# Altium project Urukul.PrjPCB (part 1 of 4)
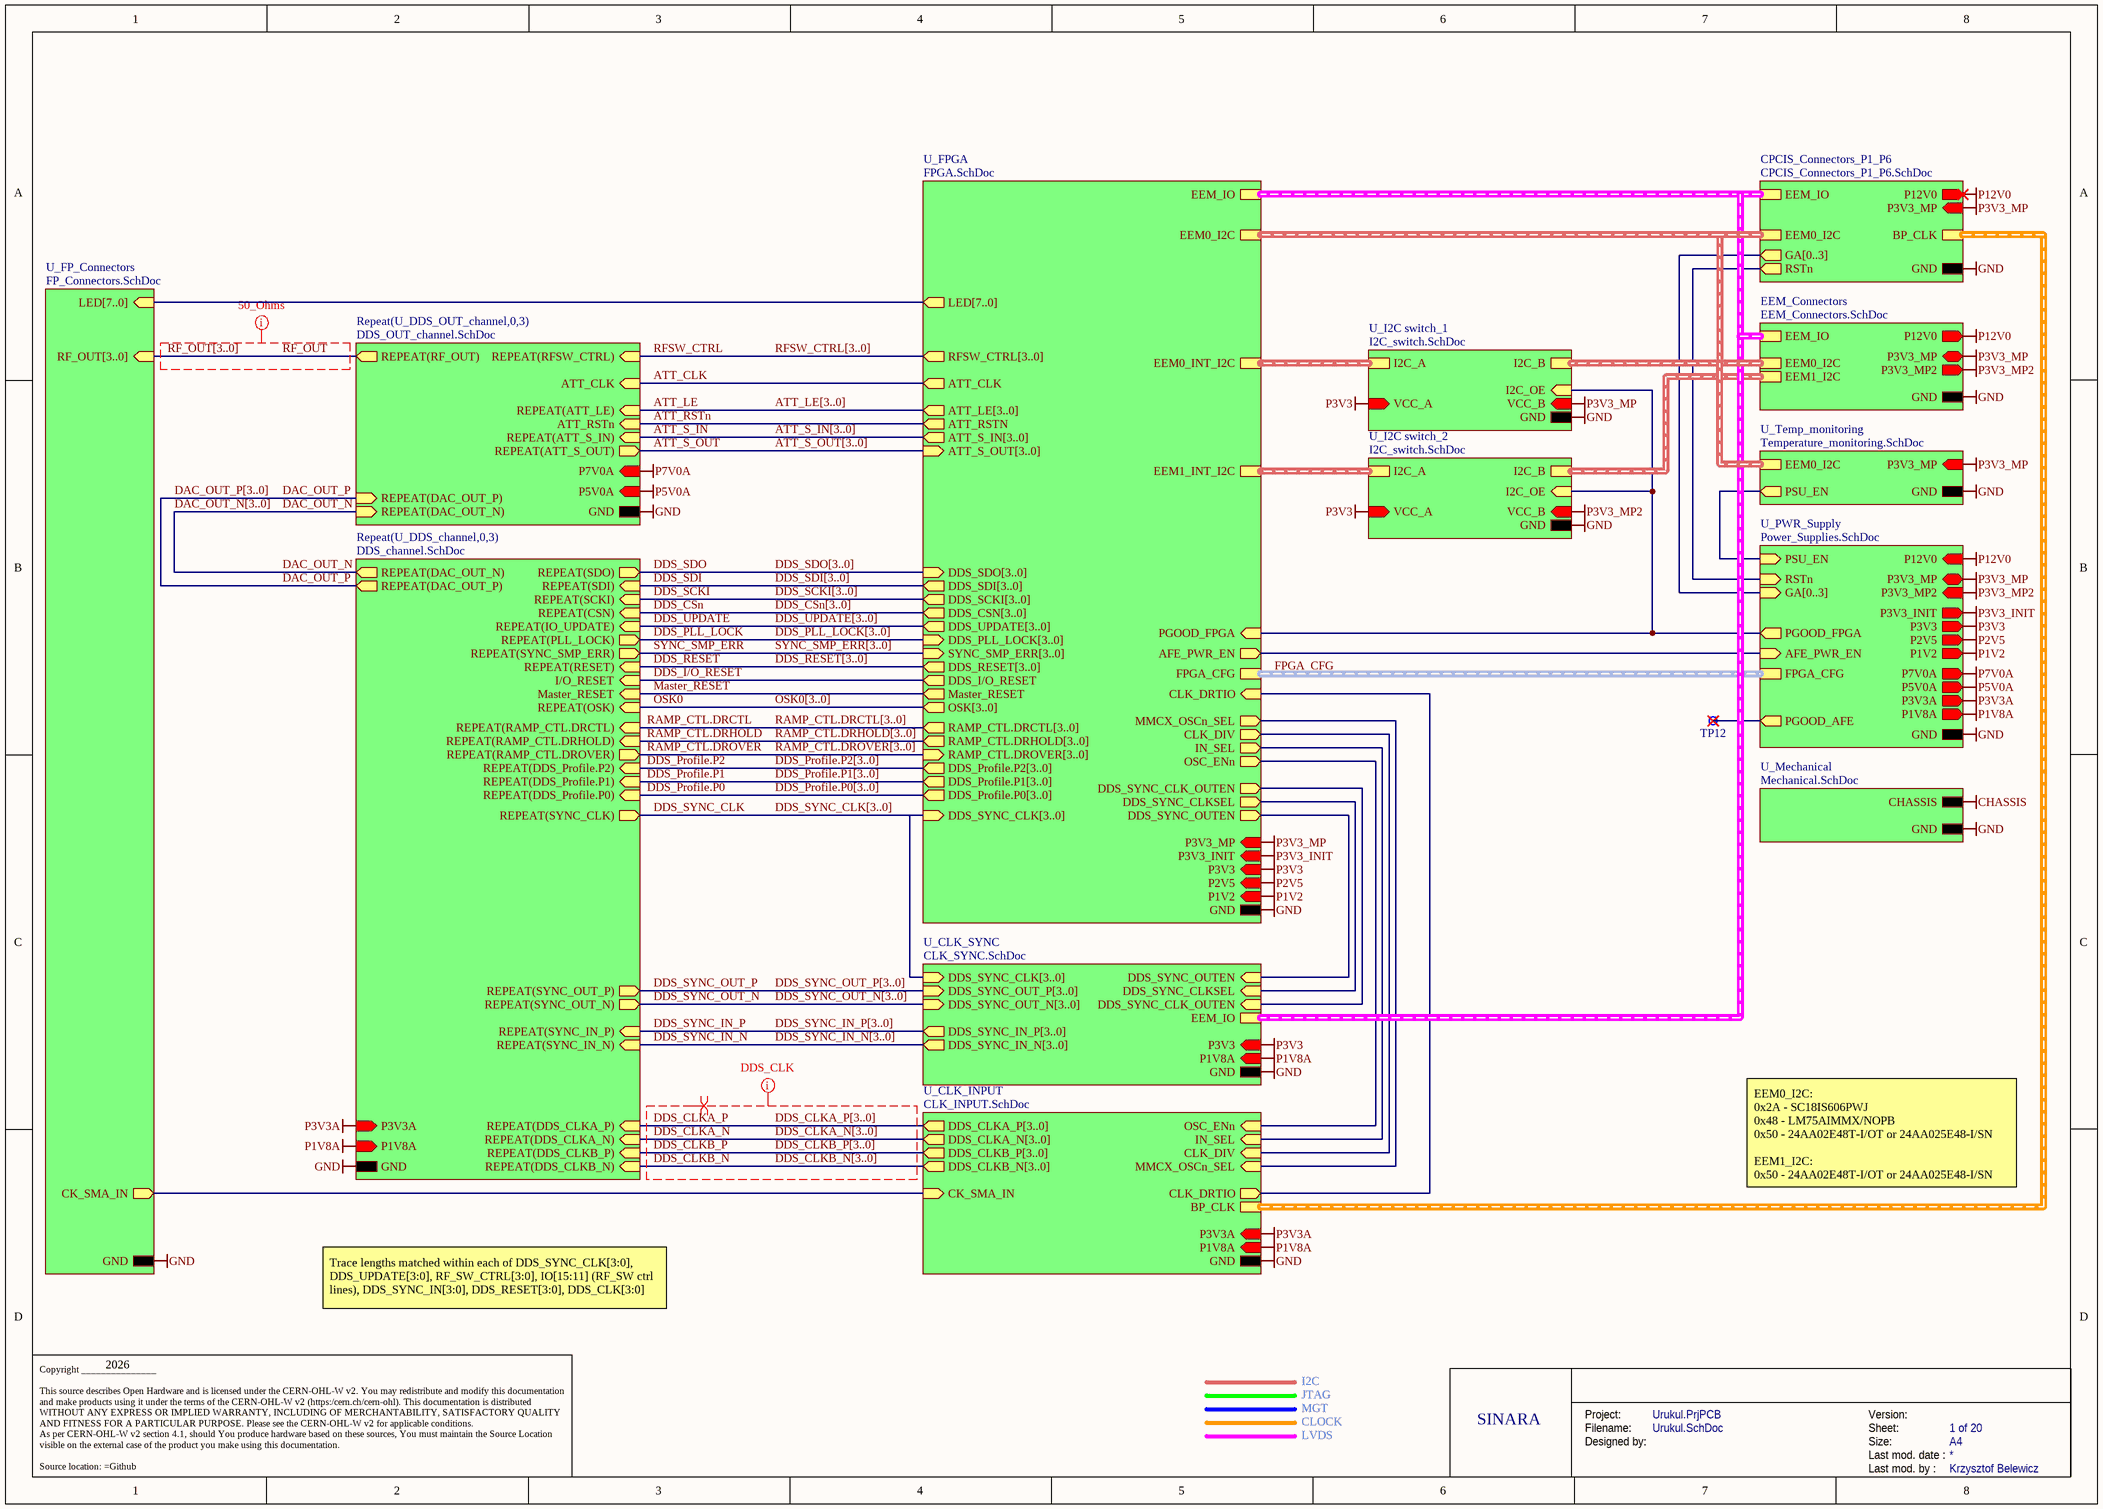
[diagram p0: Urukul.SchDoc]
P_author1: Grzegorz Kasprowicz; P_author2: Filip Światkowski, Paweł Kulik, Maciej Przybysz; P_author3: Krzysztof Belewicz; P_github_link: https://github.com/sinara-hw/Urukul; P_template_version: DIOT-Template v1.3; P_version: 1.6
10 sheets, 342 parts. Net scope: strictly hierarchical (ports join the sheet entries above them; power ports are local).
Board file: Urukul.PcbDoc
Sheets:
  Urukul.SchDoc
    CPCIS_Connectors_P1_P6 = CPCIS_Connectors_P1_P6.SchDoc
    U_PWR_Supply = Power_Supplies.SchDoc
      U_Power_main_DCDC = Power_main_DCDC.SchDoc
      LEDs = LEDs.SchDoc
    U_FPGA = FPGA.SchDoc
      U_FPGA_Supply = FPGA_Supply.SchDoc
      U_FPGA_Bank0-2 = FPGA_Bank0-2.SchDoc
      U_FPGA_Config = FPGA_Config.SchDoc
    U_I2C switch_1 = I2C_switch.SchDoc
    U_I2C switch_2 = I2C_switch.SchDoc

## Sheet Urukul.SchDoc: =DocumentName
size A3; DocumentNumber: 1; Revision: 0; SheetNumber: 1; SheetTotal: 20; Version: 1.6; Author 1: Grzegorz Kasprowicz; Author 2: Filip Światkowski, Paweł Kulik, Maciej Przybysz; Author 3: Krzysztof Belewicz; Github: https://github.com/sinara-hw/Urukul; Last modified by: Krzysztof Belewicz

### Parts
TP12  Test Point  [TPS127]  (value not drawn)  (no BOM)

### Sub-sheets
CPCIS_Connectors_P1_P6 = CPCIS_Connectors_P1_P6.SchDoc: P12V0 (out), P3V3_MP (in), EEM_IO (harness EEM_LVDS), EEM0_I2C (harness I2C), BP_CLK (harness CLK_DIFF), GA[0..3] (out), GND, RSTn (out)
EEM_Connectors = EEM_Connectors.SchDoc (file not in this document): P3V3_MP (bidir), P12V0 (out), EEM_IO (harness EEM_LVDS), EEM0_I2C (harness I2C), GND, P3V3_MP2 (out), EEM1_I2C (harness I2C)
Repeat(U_DDS_channel,0,3) = DDS_channel.SchDoc (file not in this document): REPEAT(CSN) (in), REPEAT(SDI) (in), REPEAT(SCKI) (in), REPEAT(SDO) (out), REPEAT(DAC_OUT_P) (out), REPEAT(DAC_OUT_N) (out), REPEAT(RESET) (in), REPEAT(IO_UPDATE) (in), REPEAT(SYNC_CLK) (out), I/O_RESET (in), REPEAT(SYNC_SMP_ERR) (out), REPEAT(PLL_LOCK) (out), Master_RESET (in), REPEAT(OSK) (in), GND, P1V8A (in), P3V3A (in), REPEAT(SYNC_IN_P) (in), REPEAT(SYNC_IN_N) (in), REPEAT(SYNC_OUT_P) (out), REPEAT(SYNC_OUT_N) (out), REPEAT(DDS_CLKB_P) (in), REPEAT(DDS_CLKB_N) (in), REPEAT(DDS_CLKA_P) (in), REPEAT(DDS_CLKA_N) (in), REPEAT(RAMP_CTL.DROVER) (out), REPEAT(RAMP_CTL.DRHOLD) (in), REPEAT(RAMP_CTL.DRCTL) (in), REPEAT(DDS_Profile.P2) (in), REPEAT(DDS_Profile.P1) (in), REPEAT(DDS_Profile.P0) (in)
Repeat(U_DDS_OUT_channel,0,3) = DDS_OUT_channel.SchDoc (file not in this document): REPEAT(RF_OUT) (out), REPEAT(RFSW_CTRL) (in), ATT_CLK (in), REPEAT(ATT_S_IN) (in), REPEAT(ATT_LE) (in), ATT_RSTn (in), REPEAT(ATT_S_OUT) (out), GND, P7V0A (in), P5V0A (in), REPEAT(DAC_OUT_P) (in), REPEAT(DAC_OUT_N) (in)
U_CLK_INPUT = CLK_INPUT.SchDoc (file not in this document): DDS_CLKA_P[3..0] (out), DDS_CLKA_N[3..0] (out), BP_CLK (harness CLK_DIFF), CK_SMA_IN (in), IN_SEL (in), CLK_DIV (in), MMCX_OSCn_SEL (in), OSC_ENn (in), DDS_CLKB_P[3..0] (out), DDS_CLKB_N[3..0] (out), P3V3A (in), GND, P1V8A (in), CLK_DRTIO (out)
U_CLK_SYNC = CLK_SYNC.SchDoc (file not in this document): DDS_SYNC_OUT_P[3..0] (in), DDS_SYNC_OUT_N[3..0] (in), DDS_SYNC_IN_P[3..0] (out), DDS_SYNC_IN_N[3..0] (out), DDS_SYNC_CLK_OUTEN (in), DDS_SYNC_CLKSEL (in), DDS_SYNC_OUTEN (in), EEM_IO (harness EEM_LVDS), DDS_SYNC_CLK[3..0] (in), GND, P3V3 (in), P1V8A (in)
U_FP_Connectors = FP_Connectors.SchDoc (file not in this document): GND, CK_SMA_IN (out), LED[7..0] (in), RF_OUT[3..0] (in)
U_FPGA = FPGA.SchDoc: EEM_IO (harness EEM_LVDS), EEM0_I2C (harness I2C), PGOOD_FPGA (in), FPGA_CFG (harness FPGA_CFG), EEM0_INT_I2C (harness I2C), EEM1_INT_I2C (harness I2C), LED[7..0] (out), RFSW_CTRL[3..0] (out), ATT_S_IN[3..0] (out), ATT_S_OUT[3..0] (in), ATT_CLK (out), ATT_LE[3..0] (out), ATT_RSTN (out), DDS_SYNC_CLK[3..0] (in), OSK[3..0] (out), Master_RESET (out), DDS_UPDATE[3..0] (out), DDS_CSN[3..0] (out), DDS_SCKI[3..0] (out), DDS_SDI[3..0] (out), DDS_SDO[3..0] (in), DDS_I/O_RESET (out), DDS_PLL_LOCK[3..0] (in), SYNC_SMP_ERR[3..0] (in), DDS_RESET[3..0] (out), RAMP_CTL.DRCTL[3..0] (out), RAMP_CTL.DRHOLD[3..0] (out), RAMP_CTL.DROVER[3..0] (in), DDS_Profile.P2[3..0] (out), DDS_Profile.P1[3..0] (out), DDS_Profile.P0[3..0] (out), AFE_PWR_EN (out), DDS_SYNC_CLKSEL (out), DDS_SYNC_OUTEN (out), DDS_SYNC_CLK_OUTEN (out), IN_SEL (out), CLK_DIV (out), MMCX_OSCn_SEL (out), OSC_ENn (out), CLK_DRTIO (in), P3V3_MP (in), P3V3_INIT (in), P3V3 (in), P2V5 (in), P1V2 (in), GND
U_I2C switch_1 = I2C_switch.SchDoc: I2C_A (harness I2C), I2C_B (harness I2C), I2C_OE (in), GND, VCC_A (in), VCC_B (in)
U_I2C switch_2 = I2C_switch.SchDoc: I2C_A (harness I2C), I2C_B (harness I2C), I2C_OE (in), GND, VCC_A (in), VCC_B (in)
U_Mechanical = Mechanical.SchDoc (file not in this document): CHASSIS, GND
U_PWR_Supply = Power_Supplies.SchDoc: GND, P12V0 (in), P3V3 (out), P3V3_MP (bidir), PGOOD_AFE (out), GA[0..3] (in), RSTn (in), PSU_EN (in), P3V3_MP2 (in), P3V3_INIT (out), P2V5 (out), P1V2 (out), P3V3A (out), P1V8A (out), P5V0A (out), P7V0A (out), AFE_PWR_EN (in), PGOOD_FPGA (out), FPGA_CFG (harness FPGA_CFG)
U_Temp_monitoring = Temperature_monitoring.SchDoc (file not in this document): GND, P3V3_MP (in), EEM0_I2C (harness I2C), PSU_EN (out)

### Nets
CHASSIS: sheet U_Mechanical/CHASSIS
GND: sheet CPCIS_Connectors_P1_P6/GND, sheet EEM_Connectors/GND, sheet U_Temp_monitoring/GND, sheet U_Mechanical/GND, sheet U_FP_Connectors/GND, sheet U_CLK_INPUT/GND, sheet Repeat(U_DDS_OUT_channel,0,3)/GND, sheet Repeat(U_DDS_channel,0,3)/GND, sheet U_CLK_SYNC/GND, sheet U_PWR_Supply/GND, sheet U_FPGA/GND, sheet U_I2C switch_1/GND, sheet U_I2C switch_2/GND
P1V2: sheet U_PWR_Supply/P1V2, sheet U_FPGA/P1V2
P1V8A: sheet U_CLK_INPUT/P1V8A, sheet Repeat(U_DDS_channel,0,3)/P1V8A, sheet U_CLK_SYNC/P1V8A, sheet U_PWR_Supply/P1V8A
P2V5: sheet U_PWR_Supply/P2V5, sheet U_FPGA/P2V5
P3V3: sheet U_CLK_SYNC/P3V3, sheet U_PWR_Supply/P3V3, sheet U_FPGA/P3V3, sheet U_I2C switch_1/VCC_A, sheet U_I2C switch_2/VCC_A
P3V3_INIT: sheet U_PWR_Supply/P3V3_INIT, sheet U_FPGA/P3V3_INIT
P3V3_MP: sheet CPCIS_Connectors_P1_P6/P3V3_MP, sheet EEM_Connectors/P3V3_MP, sheet U_Temp_monitoring/P3V3_MP, sheet U_PWR_Supply/P3V3_MP, sheet U_FPGA/P3V3_MP, sheet U_I2C switch_1/VCC_B
P3V3_MP2: sheet EEM_Connectors/P3V3_MP2, sheet U_PWR_Supply/P3V3_MP2, sheet U_I2C switch_2/VCC_B
P3V3A: sheet U_CLK_INPUT/P3V3A, sheet Repeat(U_DDS_channel,0,3)/P3V3A, sheet U_PWR_Supply/P3V3A
P5V0A: sheet Repeat(U_DDS_OUT_channel,0,3)/P5V0A, sheet U_PWR_Supply/P5V0A
P7V0A: sheet Repeat(U_DDS_OUT_channel,0,3)/P7V0A, sheet U_PWR_Supply/P7V0A
P12V0: sheet CPCIS_Connectors_P1_P6/P12V0, sheet EEM_Connectors/P12V0, sheet U_PWR_Supply/P12V0
AFE_PWR_EN: sheet U_PWR_Supply/AFE_PWR_EN, sheet U_FPGA/AFE_PWR_EN
ATT_CLK: sheet Repeat(U_DDS_OUT_channel,0,3)/ATT_CLK, sheet U_FPGA/ATT_CLK
ATT_LE: sheet Repeat(U_DDS_OUT_channel,0,3)/REPEAT(ATT_LE)
ATT_RSTn: sheet Repeat(U_DDS_OUT_channel,0,3)/ATT_RSTn, sheet U_FPGA/ATT_RSTN
ATT_S_IN: sheet Repeat(U_DDS_OUT_channel,0,3)/REPEAT(ATT_S_IN)
ATT_S_OUT: sheet Repeat(U_DDS_OUT_channel,0,3)/REPEAT(ATT_S_OUT)
CLK_DIV: sheet U_CLK_INPUT/CLK_DIV, sheet U_FPGA/CLK_DIV
CLK_DRTIO: sheet U_CLK_INPUT/CLK_DRTIO, sheet U_FPGA/CLK_DRTIO
DAC_OUT_N: sheet Repeat(U_DDS_OUT_channel,0,3)/REPEAT(DAC_OUT_N), sheet Repeat(U_DDS_channel,0,3)/REPEAT(DAC_OUT_N)
DAC_OUT_P: sheet Repeat(U_DDS_OUT_channel,0,3)/REPEAT(DAC_OUT_P), sheet Repeat(U_DDS_channel,0,3)/REPEAT(DAC_OUT_P)
DDS_CLKA_N: sheet Repeat(U_DDS_channel,0,3)/REPEAT(DDS_CLKA_N)
DDS_CLKA_P: sheet Repeat(U_DDS_channel,0,3)/REPEAT(DDS_CLKA_P)
DDS_CLKB_N: sheet Repeat(U_DDS_channel,0,3)/REPEAT(DDS_CLKB_N)
DDS_CLKB_P: sheet Repeat(U_DDS_channel,0,3)/REPEAT(DDS_CLKB_P)
DDS_CSn: sheet Repeat(U_DDS_channel,0,3)/REPEAT(CSN)
DDS_I/O_RESET: sheet Repeat(U_DDS_channel,0,3)/I/O_RESET, sheet U_FPGA/DDS_I/O_RESET
DDS_PLL_LOCK: sheet Repeat(U_DDS_channel,0,3)/REPEAT(PLL_LOCK)
DDS_Profile.P0: sheet Repeat(U_DDS_channel,0,3)/REPEAT(DDS_Profile.P0)
DDS_Profile.P1: sheet Repeat(U_DDS_channel,0,3)/REPEAT(DDS_Profile.P1)
DDS_Profile.P2: sheet Repeat(U_DDS_channel,0,3)/REPEAT(DDS_Profile.P2)
DDS_RESET: sheet Repeat(U_DDS_channel,0,3)/REPEAT(RESET)
DDS_SCKI: sheet Repeat(U_DDS_channel,0,3)/REPEAT(SCKI)
DDS_SDI: sheet Repeat(U_DDS_channel,0,3)/REPEAT(SDI)
DDS_SDO: sheet Repeat(U_DDS_channel,0,3)/REPEAT(SDO)
DDS_SYNC_CLK: sheet Repeat(U_DDS_channel,0,3)/REPEAT(SYNC_CLK)
DDS_SYNC_CLK_OUTEN: sheet U_CLK_SYNC/DDS_SYNC_CLK_OUTEN, sheet U_FPGA/DDS_SYNC_CLK_OUTEN
DDS_SYNC_CLKSEL: sheet U_CLK_SYNC/DDS_SYNC_CLKSEL, sheet U_FPGA/DDS_SYNC_CLKSEL
DDS_SYNC_IN_N: sheet Repeat(U_DDS_channel,0,3)/REPEAT(SYNC_IN_N)
DDS_SYNC_IN_P: sheet Repeat(U_DDS_channel,0,3)/REPEAT(SYNC_IN_P)
DDS_SYNC_OUT_N: sheet Repeat(U_DDS_channel,0,3)/REPEAT(SYNC_OUT_N)
DDS_SYNC_OUT_P: sheet Repeat(U_DDS_channel,0,3)/REPEAT(SYNC_OUT_P)
DDS_SYNC_OUTEN: sheet U_CLK_SYNC/DDS_SYNC_OUTEN, sheet U_FPGA/DDS_SYNC_OUTEN
DDS_UPDATE: sheet Repeat(U_DDS_channel,0,3)/REPEAT(IO_UPDATE)
I2C_OE: sheet U_PWR_Supply/PGOOD_FPGA, sheet U_FPGA/PGOOD_FPGA, sheet U_I2C switch_1/I2C_OE, sheet U_I2C switch_2/I2C_OE
IN_SEL: sheet U_CLK_INPUT/IN_SEL, sheet U_FPGA/IN_SEL
Master_RESET: sheet Repeat(U_DDS_channel,0,3)/Master_RESET, sheet U_FPGA/Master_RESET
MMCX_OSCn_SEL: sheet U_CLK_INPUT/MMCX_OSCn_SEL, sheet U_FPGA/MMCX_OSCn_SEL
OSC_ENn: sheet U_CLK_INPUT/OSC_ENn, sheet U_FPGA/OSC_ENn
OSK0: sheet Repeat(U_DDS_channel,0,3)/REPEAT(OSK)
PGOOD_AFE: TP12.1 ; sheet U_PWR_Supply/PGOOD_AFE
PSU_EN: sheet U_Temp_monitoring/PSU_EN, sheet U_PWR_Supply/PSU_EN
RAMP_CTL.DRCTL: sheet Repeat(U_DDS_channel,0,3)/REPEAT(RAMP_CTL.DRCTL)
RAMP_CTL.DRHOLD: sheet Repeat(U_DDS_channel,0,3)/REPEAT(RAMP_CTL.DRHOLD)
RAMP_CTL.DROVER: sheet Repeat(U_DDS_channel,0,3)/REPEAT(RAMP_CTL.DROVER)
RF_OUT: sheet Repeat(U_DDS_OUT_channel,0,3)/REPEAT(RF_OUT)
RFSW_CTRL: sheet Repeat(U_DDS_OUT_channel,0,3)/REPEAT(RFSW_CTRL)
RSTn: sheet CPCIS_Connectors_P1_P6/RSTn, sheet U_PWR_Supply/RSTn
SYNC_SMP_ERR: sheet Repeat(U_DDS_channel,0,3)/REPEAT(SYNC_SMP_ERR)
(unnamed): sheet U_FP_Connectors/CK_SMA_IN, sheet U_CLK_INPUT/CK_SMA_IN

### Buses and harness runs
bus ATT_LE[3..0] = sheet U_FPGA/ATT_LE[3..0]
bus ATT_S_IN[3..0] = sheet U_FPGA/ATT_S_IN[3..0]
bus ATT_S_OUT[3..0] = sheet U_FPGA/ATT_S_OUT[3..0]
bus DAC_OUT_N[3..0]
bus DAC_OUT_P[3..0]
bus DDS_CLKA_N[3..0] = sheet U_CLK_INPUT/DDS_CLKA_N[3..0]
bus DDS_CLKA_P[3..0] = sheet U_CLK_INPUT/DDS_CLKA_P[3..0]
bus DDS_CLKB_N[3..0] = sheet U_CLK_INPUT/DDS_CLKB_N[3..0]
bus DDS_CLKB_P[3..0] = sheet U_CLK_INPUT/DDS_CLKB_P[3..0]
bus DDS_CSn[3..0] = sheet U_FPGA/DDS_CSN[3..0]
bus DDS_PLL_LOCK[3..0] = sheet U_FPGA/DDS_PLL_LOCK[3..0]
bus DDS_Profile.P0[3..0] = sheet U_FPGA/DDS_Profile.P0[3..0]
bus DDS_Profile.P1[3..0] = sheet U_FPGA/DDS_Profile.P1[3..0]
bus DDS_Profile.P2[3..0] = sheet U_FPGA/DDS_Profile.P2[3..0]
bus DDS_RESET[3..0] = sheet U_FPGA/DDS_RESET[3..0]
bus DDS_SCKI[3..0] = sheet U_FPGA/DDS_SCKI[3..0]
bus DDS_SDI[3..0] = sheet U_FPGA/DDS_SDI[3..0]
bus DDS_SDO[3..0] = sheet U_FPGA/DDS_SDO[3..0]
bus DDS_SYNC_CLK[3..0] = sheet U_CLK_SYNC/DDS_SYNC_CLK[3..0] = sheet U_FPGA/DDS_SYNC_CLK[3..0]
bus DDS_SYNC_IN_N[3..0] = sheet U_CLK_SYNC/DDS_SYNC_IN_N[3..0]
bus DDS_SYNC_IN_P[3..0] = sheet U_CLK_SYNC/DDS_SYNC_IN_P[3..0]
bus DDS_SYNC_OUT_N[3..0] = sheet U_CLK_SYNC/DDS_SYNC_OUT_N[3..0]
bus DDS_SYNC_OUT_P[3..0] = sheet U_CLK_SYNC/DDS_SYNC_OUT_P[3..0]
bus DDS_UPDATE[3..0] = sheet U_FPGA/DDS_UPDATE[3..0]
bus OSK0[3..0] = sheet U_FPGA/OSK[3..0]
bus RAMP_CTL.DRCTL[3..0] = sheet U_FPGA/RAMP_CTL.DRCTL[3..0]
bus RAMP_CTL.DRHOLD[3..0] = sheet U_FPGA/RAMP_CTL.DRHOLD[3..0]
bus RAMP_CTL.DROVER[3..0] = sheet U_FPGA/RAMP_CTL.DROVER[3..0]
bus RF_OUT[3..0] = sheet U_FP_Connectors/RF_OUT[3..0]
bus RFSW_CTRL[3..0] = sheet U_FPGA/RFSW_CTRL[3..0]
bus sheet CPCIS_Connectors_P1_P6/GA[0..3] = sheet U_PWR_Supply/GA[0..3]
bus sheet U_FP_Connectors/LED[7..0] = sheet U_FPGA/LED[7..0]
bus SYNC_SMP_ERR[3..0] = sheet U_FPGA/SYNC_SMP_ERR[3..0]
harness FPGA_CFG = sheet U_FPGA/FPGA_CFG = sheet U_PWR_Supply/FPGA_CFG
harness sheet CPCIS_Connectors_P1_P6/BP_CLK = sheet U_CLK_INPUT/BP_CLK
harness sheet CPCIS_Connectors_P1_P6/EEM0_I2C = sheet EEM_Connectors/EEM0_I2C = sheet U_FPGA/EEM0_I2C = sheet U_I2C switch_1/I2C_B = sheet U_Temp_monitoring/EEM0_I2C
harness sheet CPCIS_Connectors_P1_P6/EEM_IO = sheet EEM_Connectors/EEM_IO = sheet U_CLK_SYNC/EEM_IO = sheet U_FPGA/EEM_IO
harness sheet EEM_Connectors/EEM1_I2C = sheet U_I2C switch_2/I2C_B
harness sheet U_FPGA/EEM0_INT_I2C = sheet U_I2C switch_1/I2C_A
harness sheet U_FPGA/EEM1_INT_I2C = sheet U_I2C switch_2/I2C_A

### Layout directives
net class DDS_CLK: DDS_CLKA_N, DDS_CLKA_N[3..0], DDS_CLKA_P, DDS_CLKA_P[3..0], DDS_CLKB_N, DDS_CLKB_N[3..0], DDS_CLKB_P, DDS_CLKB_P[3..0]
net class 50_Ohms: RF_OUT, RF_OUT[3..0]
differential pair: DDS_CLKA_N, DDS_CLKA_N[3..0], DDS_CLKA_P, DDS_CLKA_P[3..0], DDS_CLKB_N, DDS_CLKB_N[3..0], DDS_CLKB_P, DDS_CLKB_P[3..0]

### Notes on the sheet
- EEM0_I2C:
  0x2A - SC18IS606PWJ
  0x48 - LM75AIMMX/NOPB
  0x50 - 24AA02E48T-I/OT or 24AA025E48-I/SN
  EEM1_I2C:
  0x50 - 24AA02E48T-I/OT or 24AA025E48-I/SN
- Trace lengths matched within each of DDS_SYNC_CLK[3:0], DDS_UPDATE[3:0], RF_SW_CTRL[3:0], IO[15:11] (RF_SW ctrl lines), DDS_SYNC_IN[3:0], DDS_RESET[3:0], DDS_CLK[3:0]
- 2026
- I2C
- JTAG
- MGT
- CLOCK
- LVDS
- SINARA
- Project:
- Designed by:
- Filename:
- Size:
- Version:
- Last mod. date :
- Sheet:
- A4
- Copyright _______________
  This source describes Open Hardware and is licensed under the CERN-OHL-W v2. You may redistribute and modify this documentation and make products using it under the terms of the CERN-OHL-W v2 (https:/cern.ch/cern-ohl). This documentation is distributed WITHOUT ANY EXPRESS OR IMPLIED WARRANTY, INCLUDING OF MERCHANTABILITY, SATISFACTORY QUALITY AND FITNESS FOR A PARTICULAR PURPOSE. Please see the CERN-OHL-W v2 for applicable conditions.
  As per CERN-OHL-W v2 section 4.1, should You produce hardware based on these sources, You must maintain the Source Location visible on the external case of the product you make using this documentation.
  Source location: =Github
- Last mod. by :

### Library data of the parts
TP12 = SMD_PAD_1.27X1.27MM: Part Description: 1.27mm x 1.27mm PCB Copper Area (SMD Test Point); Mounted: No; Part Number: SMD_PAD_1.27X1.27MM; Component Type: Standard (No BOM); Pin Count: 1; Family: Test Point; Socket: No; SMD: Yes; Sense: No; Status: None; ComponentHeight: 0mm; HelpURL: Undefined; Author: CERN DEM JLC; CreateDate: 12.01.2008; LatestRevisionDate: 12.01.2008; PackageDescription: 1.27mm x 1.27mm PCB Copper Area (SMD Test Point)

## Sheet CPCIS_Connectors_P1_P6.SchDoc: =DocumentName
size A3; SPICEModelCacheRMUUFYQV: <root> / <DocumentId>RMUUFYQV</DocumentId> / </root>; DocumentNumber: 1; Revision: 0; SheetNumber: 8; SheetTotal: 20; Version: 1.6; Author 1: Grzegorz Kasprowicz; Author 2: Filip Światkowski, Paweł Kulik, Maciej Przybysz; Author 3: Krzysztof Belewicz; Github: https://github.com/sinara-hw/Urukul; Last modified by: Krzysztof Belewicz
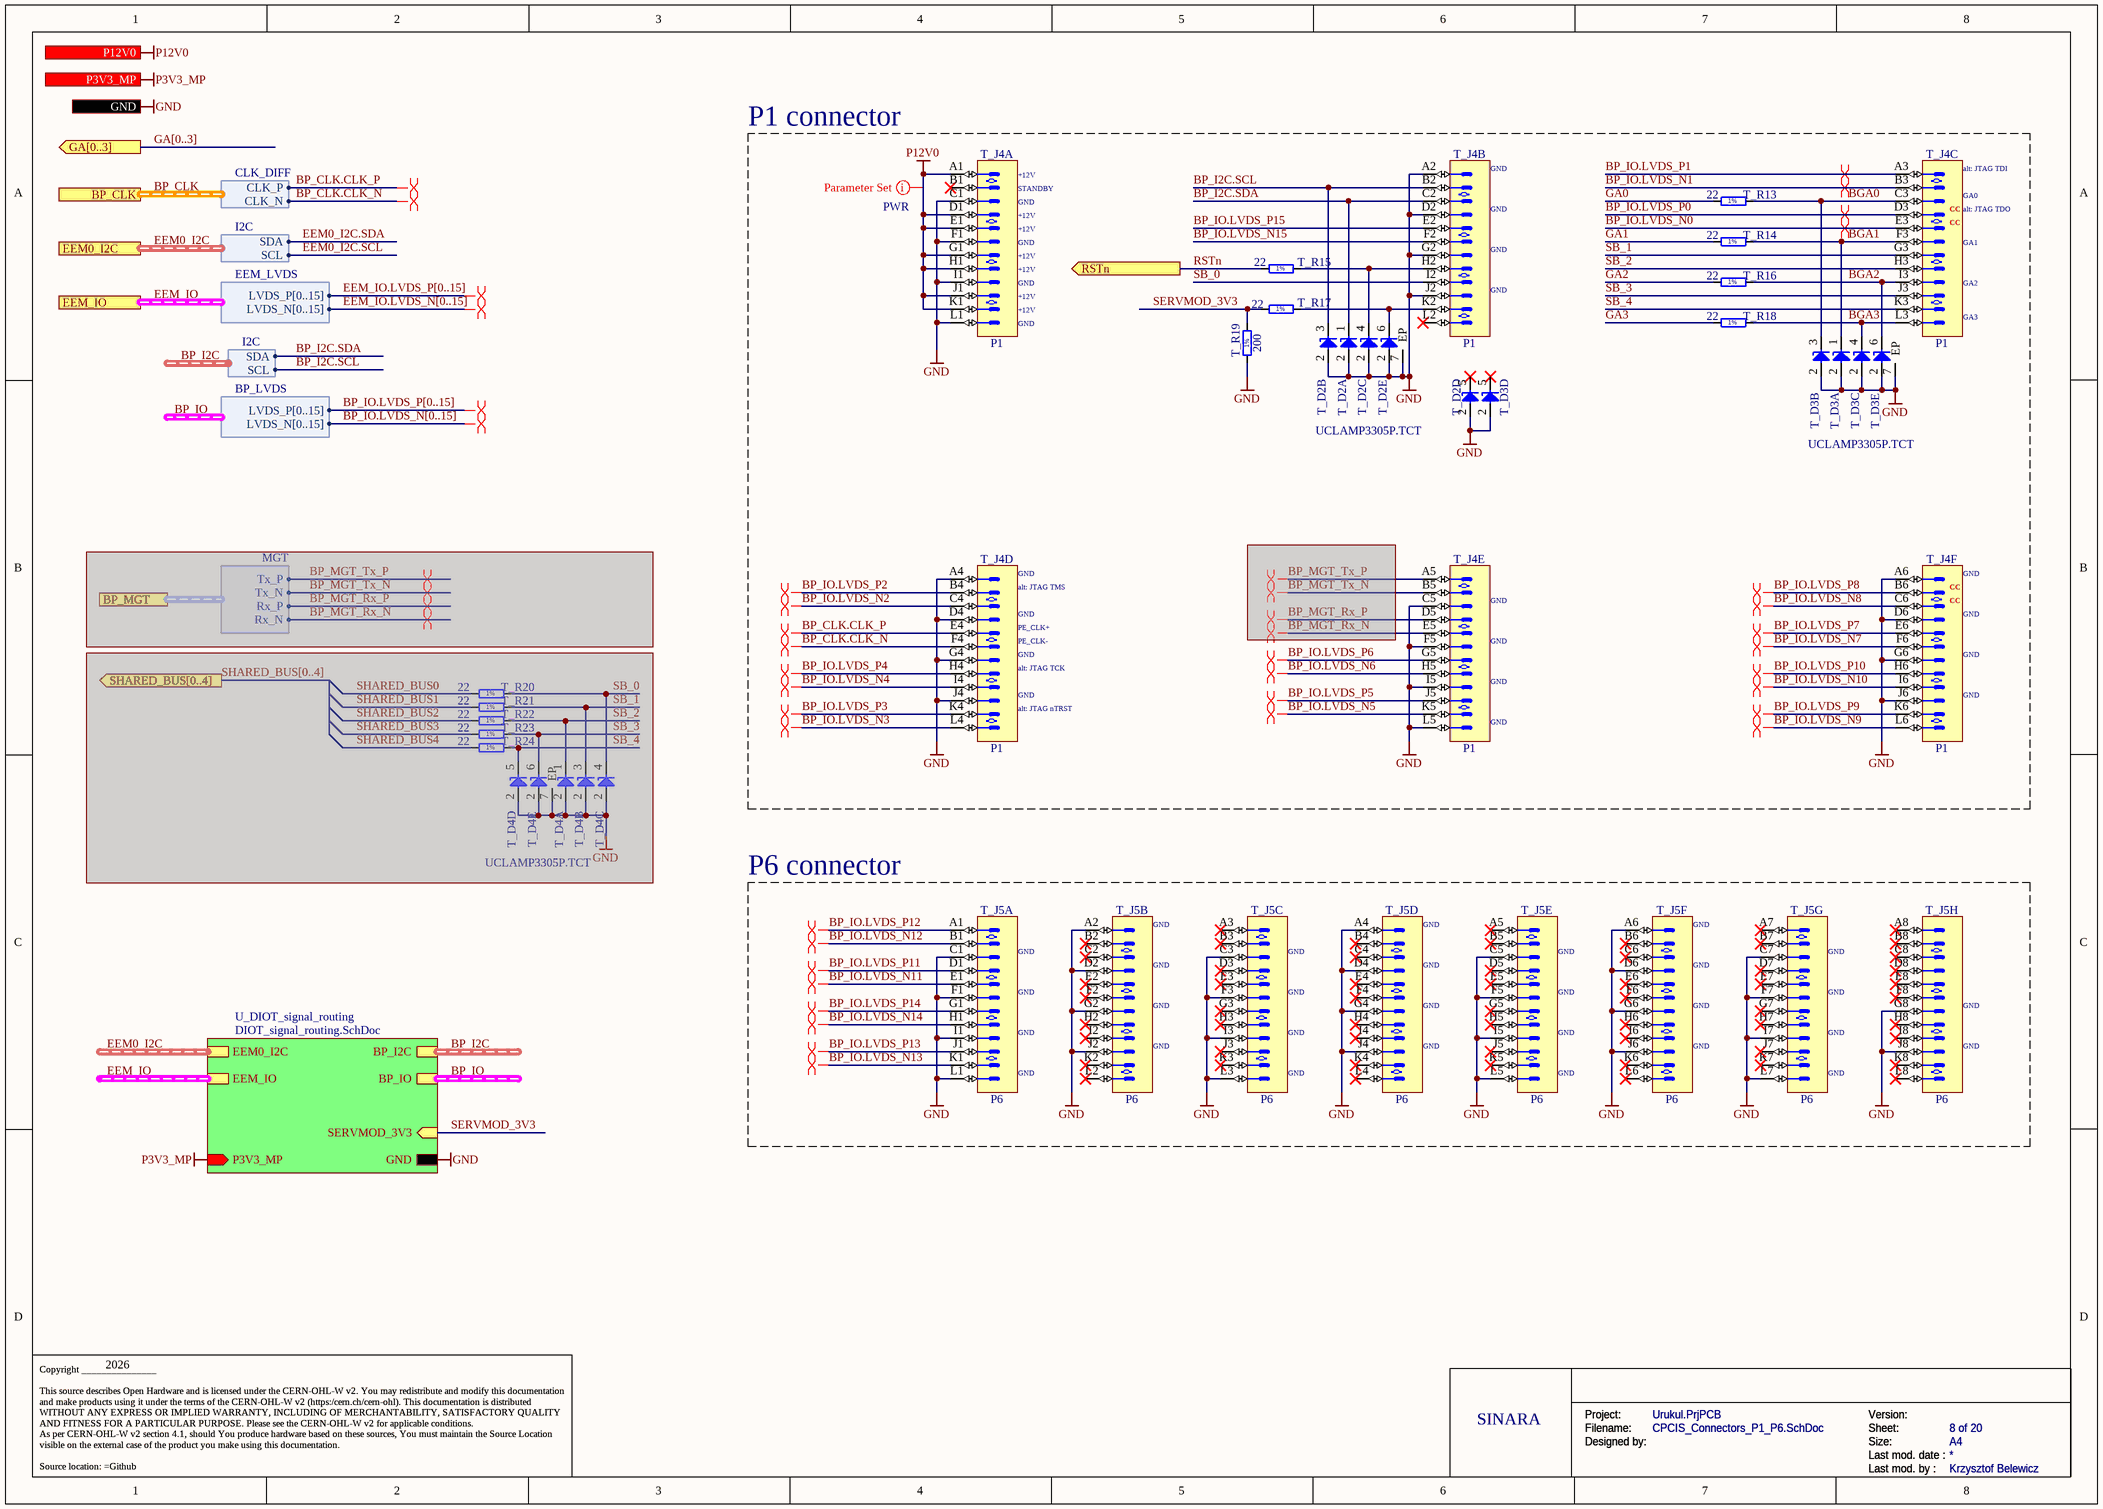
[diagram p1: CPCIS_Connectors_P1_P6.SchDoc]

### Parts
T_D2  UCLAMP3305P.TCT  [SON50P160X65_HS-7N]  (value not drawn)  (parts A,B,C,D,E of 5)
T_D3  UCLAMP3305P.TCT  [SON50P160X65_HS-7N]  (value not drawn)  (parts A,B,C,D,E of 5)
T_D4  UCLAMP3305P.TCT  [SON50P160X65_HS-7N]  (value not drawn)  (parts A,B,C,D,E of 5)  (masked out: inside a compile mask, not in the netlist)
T_J4  P1  [AMPHENOL_10052825-101LF]  (parts A,B,C,D,E,F of 6)
T_J5  P6  [AMPHENOL_10052838-101LF]  (parts A,B,C,D,E,F,G,H of 8)
T_R13  22  [RESC1005X40N]
T_R14  22  [RESC1005X40N]
T_R15  22  [RESC1005X40N]
T_R16  22  [RESC1005X40N]
T_R17  22  [RESC1005X40N]
T_R18  22  [RESC1005X40N]
T_R19  200  [RESC1005X40N]
T_R20  22  [RESC1005X40N]  (masked out: inside a compile mask, not in the netlist)
T_R21  22  [RESC1005X40N]  (masked out: inside a compile mask, not in the netlist)
T_R22  22  [RESC1005X40N]  (masked out: inside a compile mask, not in the netlist)
T_R23  22  [RESC1005X40N]  (masked out: inside a compile mask, not in the netlist)
T_R24  22  [RESC1005X40N]  (masked out: inside a compile mask, not in the netlist)

### Blocks framed on the sheet
P1 connector: T_D2 T_D3 T_J4 T_R13-T_R19
P6 connector: T_J5

### Sub-sheets
U_DIOT_signal_routing = DIOT_signal_routing.SchDoc (file not in this document): BP_I2C (harness I2C), EEM0_I2C (harness I2C), EEM_IO (harness EEM_LVDS), BP_IO (harness BP_LVDS), SERVMOD_3V3 (in), GND, P3V3_MP (in)

### Ports
BP_CLK (harness CLK_DIFF), BP_MGT (harness MGT), EEM0_I2C (harness I2C), EEM_IO (harness EEM_LVDS), GA[0..3] (out), GND, P3V3_MP (in), P12V0 (out), RSTn (out), SHARED_BUS[0..4] (out)

### Harnesses
MGT: Tx_P, Tx_N, Rx_P, Rx_N
CLK_DIFF: CLK_N, CLK_P
I2C: SDA, SCL
EEM_LVDS: LVDS_P[0..15], LVDS_N[0..15]
BP_LVDS: LVDS_N[0..15], LVDS_P[0..15]

### Nets
GND: T_D2.2(A) T_D2.7(EP) T_D3.2(A) T_D3.7(EP) T_J4.A2 T_J4.A4 T_J4.A6 T_J4.C1 T_J4.C5 T_J4.D2 T_J4.D4 T_J4.D6 T_J4.F1 T_J4.F5 T_J4.G2 T_J4.G4 T_J4.G6 T_J4.I1 T_J4.I5 T_J4.J2 T_J4.J4 T_J4.J6 T_J4.L1 T_J4.L5 T_J5.A2 T_J5.A4 T_J5.A6 T_J5.C1 T_J5.C3 T_J5.C5 T_J5.C7 T_J5.D2 T_J5.D4 T_J5.D6 T_J5.F1 T_J5.F3 T_J5.F5 T_J5.F7 T_J5.G2 T_J5.G4 T_J5.G6 T_J5.G8 T_J5.I1 T_J5.I3 T_J5.I5 T_J5.I7 T_J5.J2 T_J5.J4 T_J5.J6 T_J5.J8 T_J5.L1 T_J5.L3 T_J5.L5 T_J5.L7 T_R19.1 ; port GND, sheet U_DIOT_signal_routing/GND
P3V3_MP: port P3V3_MP, sheet U_DIOT_signal_routing/P3V3_MP
P12V0: T_J4.A1 T_J4.D1 T_J4.E1 T_J4.G1 T_J4.H1 T_J4.J1 T_J4.K1 ; port P12V0
BGA0: T_D3.3(C) T_J4.C3 T_R13.2
BGA1: T_D3.1(C) T_J4.F3 T_R14.2
BGA2: T_D3.6(C) T_J4.I3 T_R16.2
BGA3: T_D3.4(C) T_J4.L3 T_R18.2
BP_CLK.CLK_N: T_J4.F4 ; port BP_CLK.CLK_N
BP_CLK.CLK_P: T_J4.E4 ; port BP_CLK.CLK_P
BP_I2C.SCL: T_D2.3(C) T_J4.B2 ; sheet U_DIOT_signal_routing/BP_I2C.SCL
BP_I2C.SDA: T_D2.1(C) T_J4.C2 ; sheet U_DIOT_signal_routing/BP_I2C.SDA
BP_IO.LVDS_N0: T_J4.E3
BP_IO.LVDS_N1: T_J4.B3
BP_IO.LVDS_N2: T_J4.C4
BP_IO.LVDS_N3: T_J4.L4
BP_IO.LVDS_N4: T_J4.I4
BP_IO.LVDS_N5: T_J4.K5
BP_IO.LVDS_N6: T_J4.H5
BP_IO.LVDS_N7: T_J4.F6
BP_IO.LVDS_N8: T_J4.C6
BP_IO.LVDS_N9: T_J4.L6
BP_IO.LVDS_N10: T_J4.I6
BP_IO.LVDS_N11: T_J5.E1
BP_IO.LVDS_N12: T_J5.B1
BP_IO.LVDS_N13: T_J5.K1
BP_IO.LVDS_N14: T_J5.H1
BP_IO.LVDS_N15: T_J4.F2
BP_IO.LVDS_P0: T_J4.D3
BP_IO.LVDS_P1: T_J4.A3
BP_IO.LVDS_P2: T_J4.B4
BP_IO.LVDS_P3: T_J4.K4
BP_IO.LVDS_P4: T_J4.H4
BP_IO.LVDS_P5: T_J4.J5
BP_IO.LVDS_P6: T_J4.G5
BP_IO.LVDS_P7: T_J4.E6
BP_IO.LVDS_P8: T_J4.B6
BP_IO.LVDS_P9: T_J4.K6
BP_IO.LVDS_P10: T_J4.H6
BP_IO.LVDS_P11: T_J5.D1
BP_IO.LVDS_P12: T_J5.A1
BP_IO.LVDS_P13: T_J5.J1
BP_IO.LVDS_P14: T_J5.G1
BP_IO.LVDS_P15: T_J4.E2
GA0: T_R13.1
GA1: T_R14.1
GA2: T_R16.1
GA3: T_R18.1
RSTn: T_R15.1 ; port RSTn
SB_0: T_J4.I2
SB_1: T_J4.G3
SB_2: T_J4.H3
SB_3: T_J4.J3
SB_4: T_J4.K3
SERVMOD_3V3: T_R17.1 T_R19.2 ; sheet U_DIOT_signal_routing/SERVMOD_3V3
NetT_D2_4: T_D2.4(C) T_J4.H2 T_R15.2
NetT_D2_6: T_D2.6(C) T_J4.K2 T_R17.2

Not connected (* = marked no-connect by the designer): T_D2 5(C)*; T_D3 5(C)*; T_J4 A5 B1* B5 D5 E5 L2*; T_J5 A3* A5* A7* A8* B2* B3* B4* B5* B6* B7* B8* C2* C4* C6* C8* D3* D5* D7* D8* E2* E3* E4* E5* E6* E7* E8* F2* F4* F6* F8* G3* G5* G7* H2* H3* H4* H5* H6* H7* H8* I2* I4* I6* I8* J3* J5* J7* K2* K3* K4* K5* K6* K7* K8* L2* L4* L6* L8*

### Buses and harness runs
bus BP_IO.LVDS_N[0..15]
bus BP_IO.LVDS_P[0..15]
bus EEM_IO.LVDS_N[0..15]
bus EEM_IO.LVDS_P[0..15]
bus GA[0..3] = port GA[0..3]
harness BP_CLK = port BP_CLK
harness BP_I2C = sheet U_DIOT_signal_routing/BP_I2C
harness BP_IO = sheet U_DIOT_signal_routing/BP_IO
harness EEM0_I2C = port EEM0_I2C
harness EEM0_I2C = sheet U_DIOT_signal_routing/EEM0_I2C
harness EEM_IO = port EEM_IO
harness EEM_IO = sheet U_DIOT_signal_routing/EEM_IO

### Layout directives
differential pair: (no net found under the mark), BP_IO.LVDS_N0, BP_IO.LVDS_N1, BP_IO.LVDS_N2, BP_IO.LVDS_N3, BP_IO.LVDS_N4, BP_IO.LVDS_N5, BP_IO.LVDS_N6, BP_IO.LVDS_N7, BP_IO.LVDS_N8, BP_IO.LVDS_N9, BP_IO.LVDS_N10, BP_IO.LVDS_N11, BP_IO.LVDS_N12, BP_IO.LVDS_N13, BP_IO.LVDS_N14, BP_IO.LVDS_P0, BP_IO.LVDS_P1, BP_IO.LVDS_P2, BP_IO.LVDS_P3, BP_IO.LVDS_P4, BP_IO.LVDS_P5, BP_IO.LVDS_P6, BP_IO.LVDS_P7, BP_IO.LVDS_P8, BP_IO.LVDS_P9, BP_IO.LVDS_P10, BP_IO.LVDS_P11, BP_IO.LVDS_P12, BP_IO.LVDS_P13, BP_IO.LVDS_P14
differential pair; differential pair class Diff_100Ohm: (no net found under the mark), BP_CLK.CLK_N, BP_CLK.CLK_P
differential pair; differential pair class MGT: (no net found under the mark), NetT_J4_A5, NetT_J4_B5, NetT_J4_D5, NetT_J4_E5
net class PWR: P12V0

### Notes on the sheet
- (near T_J4) +12V
- (near T_J4) GND
- (near T_J4) alt: JTAG TDI
- (near T_J4) STANDBY
- (near T_J4) CC
- (near T_J4) alt: JTAG TDO
- (near T_J4) GA1
- (near T_J4) GA0
- (near T_J4) GA2
- (near T_J4) GA3
- (near T_J4) alt: JTAG TMS
- (near T_J4) PE_CLK+
- (near T_J4) PE_CLK-
- (near T_J4) alt: JTAG TCK
- (near T_J4) alt: JTAG nTRST
- (near T_J5) GND
- 2026
- SINARA
- Project:
- Designed by:
- Filename:
- Size:
- Version:
- Last mod. date :
- Sheet:
- A4
- Copyright _______________
  This source describes Open Hardware and is licensed under the CERN-OHL-W v2. You may redistribute and modify this documentation and make products using it under the terms of the CERN-OHL-W v2 (https:/cern.ch/cern-ohl). This documentation is distributed WITHOUT ANY EXPRESS OR IMPLIED WARRANTY, INCLUDING OF MERCHANTABILITY, SATISFACTORY QUALITY AND FITNESS FOR A PARTICULAR PURPOSE. Please see the CERN-OHL-W v2 for applicable conditions.
  As per CERN-OHL-W v2 section 4.1, should You produce hardware based on these sources, You must maintain the Source Location visible on the external case of the product you make using this documentation.
  Source location: =Github
- Last mod. by :
- (in symbol R0402_22R_1%_0.0625W_100PPM) 1%
- (in symbol R0402_200R_1%_0.0625W_100PPM) 1%

### Library data of the parts
T_D2-T_D4 = CMP-004-00037-2: Diode TVS Quint Common Anode Uni-Dir 3.3V 40W 6-Pin SLP EP T/R; Max Operating Temperature: 125°C; Min Operating Temperature: -55°C; Pins: 6; Mounting Technology: Surface Mount
T_J4 = AMPHENOL_10052825-101LF: 72 Contacts Header, 6 Columns, 4 Pairs per Column; Part Description: 72 Contacts, 2mm Pitch, 6 Columns, 4 Pairs per Column, 4 Walls, Right Angle Header; Part Number: AMPHENOL_10052825-101LF; Component Kind: Standard; Component Type: Standard; Pin Count: 72; Family: AirMax VS; Mounted: Yes; Socket: No; SMD: No; PressFit: Yes; Sense: No; Status: None; Manufacturer: AMPHENOL; Manufacturer Part Number: 10052825-101LF; ComponentHeight: 15.35mm; HelpURL: \\cern.ch\dfs\Applications\Altium\Datasheets\AMPHENOL_10052825-101LF.pdf; ComponentLink1URL: \\cern.ch\dfs\Applications\Altium\Datasheets\AMPHENOL_10052825-101LF_Application.pdf; ComponentLink1Description: Application; Author: CERN DEM MR; CreateDate: 19/02/2018; LatestRevisionDate: 19/02/2018; Classname: Overlapping
T_J5 = AMPHENOL_10052838-101LF: 96 Contacts Header, 8 Columns, 4 Pairs per Column; Part Description: 96 Contacts, 2mm Pitch, 8 Columns, 4 Pairs per Column, 4 Walls, Right Angle Header; Part Number: AMPHENOL_10052838-101LF; Component Kind: Standard; Component Type: Standard; Pin Count: 96; Family: AirMax VS; Mounted: Yes; Socket: No; SMD: No; PressFit: Yes; Sense: No; Status: None; Manufacturer: AMPHENOL; Manufacturer Part Number: 10052838-101LF; ComponentHeight: 15.35mm; HelpURL: \\cern.ch\dfs\Applications\Altium\Datasheets\AMPHENOL_10052838-101LF.pdf; ComponentLink1URL: \\cern.ch\dfs\Applications\Altium\Datasheets\AMPHENOL_10052838-101LF_Application.pdf; ComponentLink1Description: Application; Author: CERN DEM MR; CreateDate: 19.02.2018; LatestRevisionDate: 19.02.2018
T_R13-T_R18 T_R20-T_R24 = R0402_22R_1%_0.0625W_100PPM: Resistor - 1%; Part Description: General Purpose Thick Film Chip Resistor; Manufacturer: GENERIC; Manufacturer1 Part Number: 232270672209L; PressFit: No; Part Number: R0402_22R_1%_0.0625W_100PPM; Component Kind: Standard; Component Type: Standard; Pin Count: 2; Value: 22; Status: Not Recommended; Power: 0.0625W; Tolerance: ±1%; Manufacturer Part Number: R0402_22R_1%_0.0625W_100PPM; Case: 0402; Mounted: Yes; Socket: No; SMD: Yes; Manufacturer1 Example: YAGEO PHYCOMP; Manufacturer1 ComponentHeight: 0.4mm; HelpURL: \\cern.ch\dfs\Applications\Altium\Datasheets\R0402_Phycomp_RC0402.pdf; Author: CERN DEM JLC; CreateDate: 03.12.2007; LatestRevisionDate: 17.10.2012; Sense: No
T_R19 = R0402_200R_1%_0.0625W_100PPM: Resistor - 1%; Part Description: General Purpose Thick Film Chip Resistor; Manufacturer: GENERIC; Manufacturer1 Part Number: 232270672001L; TC: ±100ppm/°C; PressFit: No; Part Number: R0402_200R_1%_0.0625W_100PPM; Component Kind: Standard; Component Type: Standard; Pin Count: 2; Value: 200; Status: Not Recommended; Power: 0.0625W; Tolerance: ±1%; Manufacturer Part Number: R0402_200R_1%_0.0625W_100PPM; Case: 0402; Mounted: Yes; Sense: No; Socket: No; SMD: Yes; Manufacturer1 Example: YAGEO PHYCOMP; Manufacturer1 ComponentHeight: 0.4mm; HelpURL: \\cern.ch\dfs\Applications\Altium\Datasheets\R0402_Phycomp_RC0402.pdf; Author: CERN DEM JLC; CreateDate: 2007-12-03; LatestRevisionDate: 2012-10-17

## Sheet Power_Supplies.SchDoc: =DocumentName
size A4; DocumentNumber: 1; Revision: 0; SheetNumber: 2; SheetTotal: 20; Version: 1.6; Author 1: Grzegorz Kasprowicz; Author 2: Filip Światkowski, Paweł Kulik, Maciej Przybysz; Author 3: Krzysztof Belewicz; Github: https://github.com/sinara-hw/Urukul; Last modified by: Krzysztof Belewicz
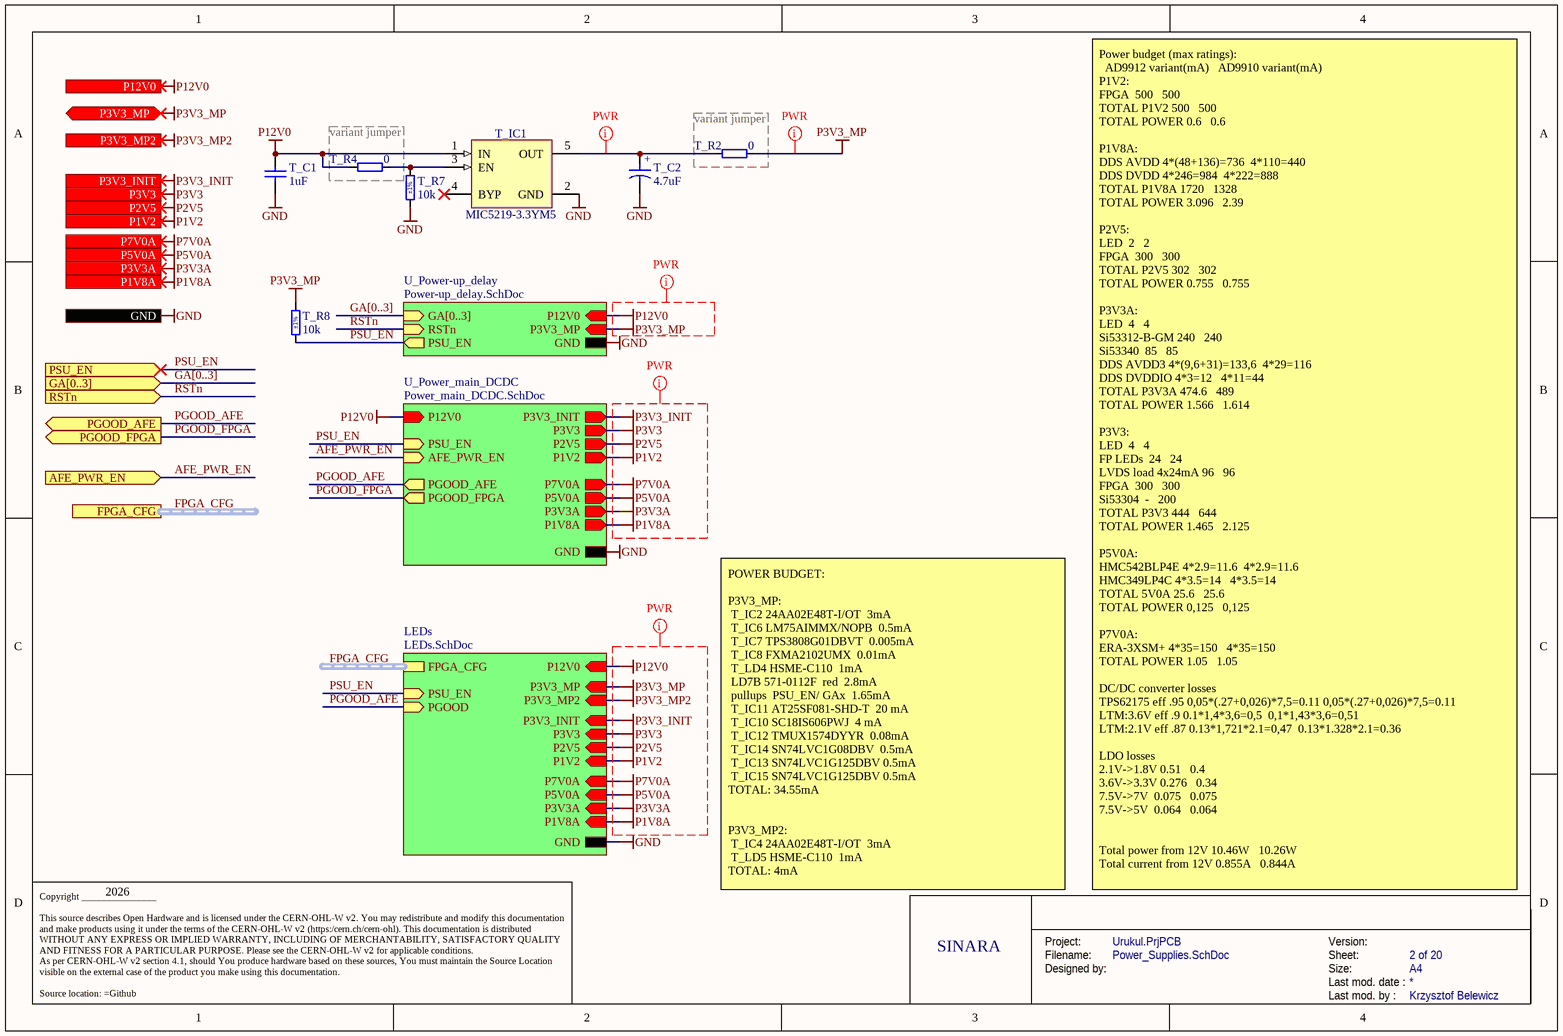
[diagram p2: Power_Supplies.SchDoc]

### Parts
T_C1  1uF  [CAPC1608X87N]
T_C2  4.7uF  [CAPMP3216X180N]
T_IC1  MIC5219-3.3YM5  [SOT95P280X145-5N]
T_R2  0  [RESC1005X40N]
T_R4  0  [RESC1005X40N]
T_R7  10k  Tolerance: ±1%  [RESC1005X40N]
T_R8  10k  Tolerance: ±1%  [RESC1005X40N]

### Blocks framed on the sheet
variant jumper: T_R4
variant jumper: T_R2

### Sub-sheets
LEDs = LEDs.SchDoc: PSU_EN (in), PGOOD (in), P3V3_MP2 (in), P12V0 (in), P3V3 (in), FPGA_CFG (harness FPGA_CFG), GND, P3V3_MP (in), P3V3_INIT (in), P2V5 (in), P1V2 (in), P7V0A (in), P5V0A (in), P3V3A (in), P1V8A (in)
U_Power-up_delay = Power-up_delay.SchDoc (file not in this document): GA[0..3] (in), RSTn (in), GND, PSU_EN (out), P3V3_MP (in), P12V0 (in)
U_Power_main_DCDC = Power_main_DCDC.SchDoc: P12V0 (in), GND, PSU_EN (in), PGOOD_AFE (out), P3V3 (out), P3V3_INIT (out), P2V5 (out), P1V2 (out), P3V3A (out), P1V8A (out), P5V0A (out), P7V0A (out), PGOOD_FPGA (out), AFE_PWR_EN (in)

### Ports
AFE_PWR_EN (in), FPGA_CFG (harness FPGA_CFG), GA[0..3] (in), GND, P1V2 (out), P1V8A (out), P2V5 (out), P3V3 (out), P3V3_INIT (out), P3V3_MP2 (in), P3V3_MP (bidir), P3V3A (out), P5V0A (out), P7V0A (out), P12V0 (in), PGOOD_AFE (out), PGOOD_FPGA (out), PSU_EN (in), RSTn (in)

### Nets
GND: T_C1.1 T_C2.2 T_IC1.2(GND) T_R7.1 ; port GND, sheet U_Power-up_delay/GND, sheet U_Power_main_DCDC/GND, sheet LEDs/GND
P1V2: port P1V2, sheet U_Power_main_DCDC/P1V2, sheet LEDs/P1V2
P1V8A: port P1V8A, sheet U_Power_main_DCDC/P1V8A, sheet LEDs/P1V8A
P2V5: port P2V5, sheet U_Power_main_DCDC/P2V5, sheet LEDs/P2V5
P3V3: port P3V3, sheet U_Power_main_DCDC/P3V3, sheet LEDs/P3V3
P3V3_INIT: port P3V3_INIT, sheet U_Power_main_DCDC/P3V3_INIT, sheet LEDs/P3V3_INIT
P3V3_MP: T_R2.2 T_R8.2 ; port P3V3_MP, sheet U_Power-up_delay/P3V3_MP, sheet LEDs/P3V3_MP
P3V3_MP2: port P3V3_MP2, sheet LEDs/P3V3_MP2
P3V3A: port P3V3A, sheet U_Power_main_DCDC/P3V3A, sheet LEDs/P3V3A
P5V0A: port P5V0A, sheet U_Power_main_DCDC/P5V0A, sheet LEDs/P5V0A
P7V0A: port P7V0A, sheet U_Power_main_DCDC/P7V0A, sheet LEDs/P7V0A
P12V0: T_C1.2 T_IC1.1(IN) T_R4.1 ; port P12V0, sheet U_Power-up_delay/P12V0, sheet U_Power_main_DCDC/P12V0, sheet LEDs/P12V0
AFE_PWR_EN: port AFE_PWR_EN, sheet U_Power_main_DCDC/AFE_PWR_EN
PGOOD_AFE: port PGOOD_AFE, sheet U_Power_main_DCDC/PGOOD_AFE, sheet LEDs/PGOOD
PGOOD_FPGA: port PGOOD_FPGA, sheet U_Power_main_DCDC/PGOOD_FPGA  [project net I2C_OE]
PSU_EN: T_R8.1 ; port PSU_EN, sheet U_Power-up_delay/PSU_EN, sheet U_Power_main_DCDC/PSU_EN, sheet LEDs/PSU_EN
RSTn: port RSTn, sheet U_Power-up_delay/RSTn
NetT_C2_1: T_C2.1 T_IC1.5(OUT) T_R2.1
NetT_IC1_3: T_IC1.3(EN) T_R4.2 T_R7.2

Not connected (* = marked no-connect by the designer): T_IC1 4(BYP)*

### Buses and harness runs
bus GA[0..3] = port GA[0..3]
bus GA[0..3] = sheet U_Power-up_delay/GA[0..3]
harness FPGA_CFG = port FPGA_CFG
harness FPGA_CFG = sheet LEDs/FPGA_CFG

### Layout directives
net class PWR: NetT_C2_1, P1V2, P1V8A, P2V5, P3V3, P3V3_INIT, P3V3_MP, P3V3_MP2, P3V3A, P5V0A, P7V0A, P12V0

### Notes on the sheet
- 2026
- POWER BUDGET:
  P3V3_MP:
  T_IC2	24AA02E48T-I/OT		3mA
  T_IC6	LM75AIMMX/NOPB		0.5mA
  T_IC7	TPS3808G01DBVT		0.005mA
  T_IC8	FXMA2102UMX		0.01mA
  T_LD4	HSME-C110		1mA
  LD7B	571-0112F	 red		2.8mA
  pullups 	PSU_EN/ GAx		1.65mA
  T_IC11	AT25SF081-SHD-T		20 mA
  T_IC10	SC18IS606PWJ		4 mA
  T_IC12	TMUX1574DYYR		0.08mA
  T_IC14	SN74LVC1G08DBV		0.5mA
  T_IC13	SN74LVC1G125DBV	0.5mA
  T_IC15	SN74LVC1G125DBV	0.5mA
  TOTAL: 34.55mA
  P3V3_MP2:
  T_IC4	24AA02E48T-I/OT		3mA
  T_LD5	HSME-C110		1mA
  TOTAL: 4mA
- Power budget (max ratings):
  AD9912 variant(mA)	 	AD9910 variant(mA)
  P1V2:
  FPGA		500			500
  TOTAL P1V2	500			500
  TOTAL POWER	0.6			0.6
  P1V8A:
  DDS AVDD	4*(48+136)=736		4*110=440
  DDS DVDD	4*246=984		4*222=888
  TOTAL P1V8A	1720			1328
  TOTAL POWER	3.096			2.39
  P2V5:
  LED		2			2
  FPGA		300			300
  TOTAL P2V5	302			302
  TOTAL POWER	0.755			0.755
  P3V3A:
  LED		4			4
  Si53312-B-GM	240			240
  Si53340		85			85
  DDS AVDD3	4*(9,6+31)=133,6		4*29=116
  DDS DVDDIO	4*3=12			4*11=44
  TOTAL P3V3A	474.6			489
  TOTAL POWER	1.566			1.614
  P3V3:
  LED		4			4
  FP LEDs		24			24
  LVDS load 4x24mA	96			96
  FPGA		300			300
  Si53304		-			200
  TOTAL P3V3	444			644
  TOTAL POWER	1.465			2.125
  P5V0A:
  HMC542BLP4E	4*2.9=11.6		4*2.9=11.6
  HMC349LP4C	4*3.5=14			4*3.5=14
  TOTAL 5V0A	25.6			25.6
  TOTAL POWER	0,125			0,125
  P7V0A:
  ERA-3XSM+	4*35=150			4*35=150
  TOTAL POWER	1.05			1.05
  DC/DC converter losses
  TPS62175 eff .95	0,05*(.27+0,026)*7,5=0.11	0,05*(.27+0,026)*7,5=0.11
  LTM:3.6V eff .9	0.1*1,4*3,6=0,5		0,1*1,43*3,6=0,51
  LTM:2.1V eff .87	0.13*1,721*2.1=0,47		0.13*1.328*2.1=0.36
  LDO losses
  2.1V->1.8V	0.51			0.4
  3.6V->3.3V	0.276			0.34
  7.5V->7V		0.075			0.075
  7.5V->5V		0.064			0.064
  Total power from 12V 10.46W			10.26W
  Total current from 12V 0.855A			0.844A
- SINARA
- Project:
- Designed by:
- Filename:
- Size:
- Version:
- Last mod. date :
- Sheet:
- A4
- Copyright _______________
  This source describes Open Hardware and is licensed under the CERN-OHL-W v2. You may redistribute and modify this documentation and make products using it under the terms of the CERN-OHL-W v2 (https:/cern.ch/cern-ohl). This documentation is distributed WITHOUT ANY EXPRESS OR IMPLIED WARRANTY, INCLUDING OF MERCHANTABILITY, SATISFACTORY QUALITY AND FITNESS FOR A PARTICULAR PURPOSE. Please see the CERN-OHL-W v2 for applicable conditions.
  As per CERN-OHL-W v2 section 4.1, should You produce hardware based on these sources, You must maintain the Source Location visible on the external case of the product you make using this documentation.
  Source location: =Github
- Last mod. by :
- (in symbol CTE3216-18_4.7UF_10V_10%_AVX_TPSA475K010T1400) +

### Library data of the parts
T_C1 = CC0603_1UF_25V_10%_X7R: Non-polarised capacitor; Part Description: SMD Multilayer Chip Ceramic Capacitor; Manufacturer: GENERIC; Manufacturer1 Part Number: GRM188R71E105KA12D; Voltage: 25V; TC: X7R; Tolerance: ±10%; Part Number: CC0603_1UF_25V_10%_X7R; Component Kind: Standard; Component Type: Standard; Pin Count: 2; Value: 1uF; Status: None; Manufacturer Part Number: CC0603_1UF_25V_10%_X7R; Case: 0603; Mounted: Yes; Socket: No; SMD: Yes; Sense: No; Manufacturer1 Example: MURATA; Manufacturer1 ComponentHeight: 0.9mm; HelpURL: \\cern.ch\dfs\Applications\Altium\Datasheets\CC0603_X7R_MURATA.pdf; Author: CERN DEM JLC; CreateDate: 18.01.2011; LatestRevisionDate: 18.01.2011
T_C2 = CTE3216-18_4.7UF_10V_10%_AVX_TPSA475K010T1400: Polarised capacitor; Part Description: Low ESR 1R4 Automotive Solid Tantalum Chip Capacitor; Manufacturer: AVX; Voltage: 10V; Tolerance: ±10%; Part Number: CTE3216-18_4.7UF_10V_10%_AVX_TPSA475K010T1400; Component Kind: Standard; Component Type: Standard; Pin Count: 2; Value: 4.7uF; Status: Preferred; Manufacturer Part Number: TPSA475K010T1400; Case: A; Mounted: Yes; Socket: No; SMD: Yes; Sense: No; ComponentHeight: 1.8mm; HelpURL: \\cern.ch\dfs\Applications\Altium\Datasheets\CTE-LESR_AVX_TPS-AUTO.pdf; Author: CERN DEM JLC; CreateDate: 23.01.2018; LatestRevisionDate: 23.01.2018
T_IC1 = MIC5219-3.3YM5: 500mA Peak Output LDO Regulator; Part Description: 3.3V 500mA Peak Output Low Drop-Out  (LDO) Regulator; Manufacturer: MICROCHIP TECHNOLOGY; PressFit: No; Bonding: No; Part Number: MIC5219-3.3YM5; Component Kind: Standard; Component Type: Standard; Device: MIC5219-3.3YM5; PackageDescription: SOT, 0.95mm pitch; 5 pin, 1.60mm W X 2.90mm L X 1.45mm H body, IPC Medium Density; Manufacturer Part Number: MIC5219-3.3YM5; Pin Count: 5; Case: SOT23-5; Mounted: Yes; Socket: No; SMD: Yes; Sense: No; ComponentHeight: 1.45mm; HelpURL: \\cern.ch\dfs\Applications\Altium\Datasheets\MIC5219-3.3YM5.pdf; Author: CERN DEM WB; CreateDate: 2019-04-16; LatestRevisionDate: 2019-04-16
T_R2 T_R4 = R0402_0R_JUMPER: Resistor; Part Description: 1A (0.05R Max DC Resistance) Zero Ohm Jumper; Manufacturer: GENERIC; Manufacturer1 Part Number: 232270591001L; PressFit: No; Part Number: R0402_0R_JUMPER; Component Kind: Standard; Component Type: Standard; Pin Count: 2; Value: 0; Status: Not Recommended; Manufacturer Part Number: R0402_0R_JUMPER; Case: 0402; Mounted: Yes; Sense: No; Socket: No; SMD: Yes; Manufacturer1 Example: YAGEO PHYCOMP; Manufacturer1 ComponentHeight: 0.4mm; HelpURL: \\cern.ch\dfs\Applications\Altium\Datasheets\R0402_Phycomp_RC0402.pdf; Author: CERN DEM JLC; CreateDate: 03.12.2007; LatestRevisionDate: 17.10.2012
T_R7 T_R8 = R0402_10K_1%_0.0625W_100PPM: Resistor - 1%; Part Description: General Purpose Thick Film Chip Resistor; Manufacturer: GENERIC; Manufacturer1 Part Number: 232270671003L; TC: ±100ppm/°C; PressFit: No; Part Number: R0402_10K_1%_0.0625W_100PPM; Component Kind: Standard; Component Type: Standard; Pin Count: 2; Value: 10k; Status: Not Recommended; Power: 0.0625W; Manufacturer Part Number: R0402_10K_1%_0.0625W_100PPM; Case: 0402; Mounted: Yes; Sense: No; Socket: No; SMD: Yes; Manufacturer1 Example: YAGEO PHYCOMP; Manufacturer1 ComponentHeight: 0.4mm; HelpURL: \\cern.ch\dfs\Applications\Altium\Datasheets\R0402_Phycomp_RC0402.pdf; Author: CERN DEM JLC; CreateDate: 03.12.2007; LatestRevisionDate: 17.10.2012